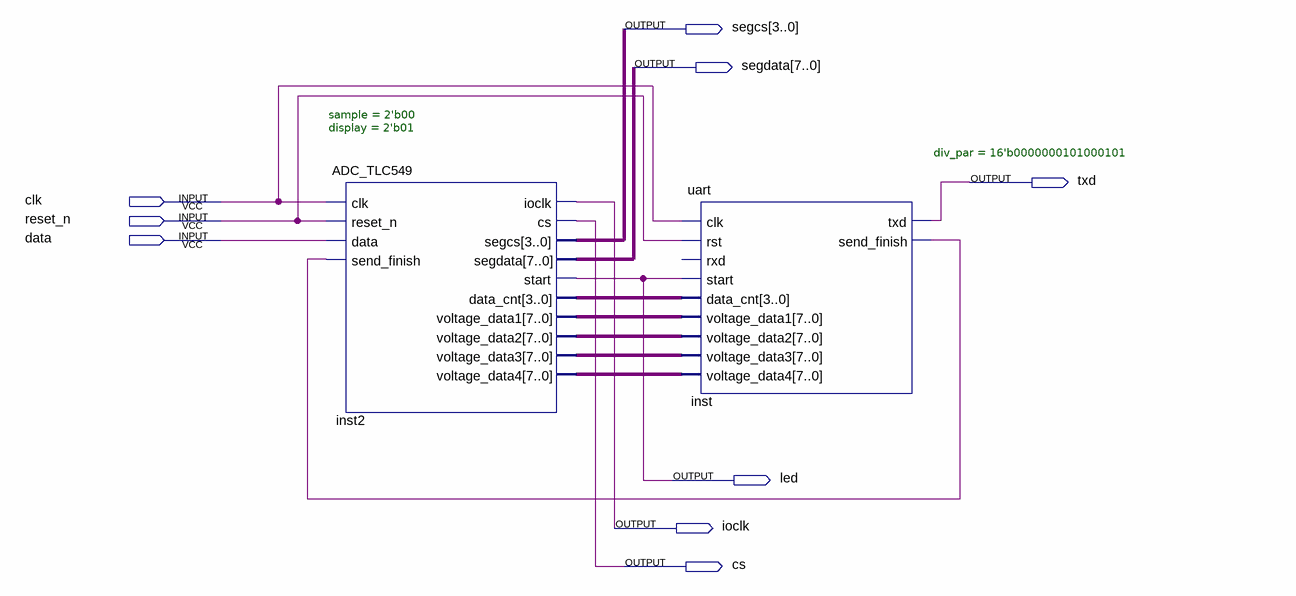
[diagram p0: schematic sheet]
// Quartus schematic top.bdf as structural Verilog: 2 symbols, 9 pins
module top (
  input  clk,
  input  reset_n,
  input  data,
  output [3:0] segcs,
  output [7:0] segdata,
  output txd,
  output led,
  output ioclk,
  output cs
);

  wire inst_send_finish;
  wire [3:0] inst2_data_cnt;
  wire [7:0] inst2_voltage_data1, inst2_voltage_data2, inst2_voltage_data3, inst2_voltage_data4;

  ADC_TLC549 #(.sample(2'b00), .display(2'b01)) inst2 (
    .clk(clk), .reset_n(reset_n), .data(data), .send_finish(inst_send_finish), .ioclk(ioclk), .cs(cs),
    .segcs(segcs), .segdata(segdata), .start(led), .data_cnt(inst2_data_cnt),
    .voltage_data1(inst2_voltage_data1), .voltage_data2(inst2_voltage_data2),
    .voltage_data3(inst2_voltage_data3), .voltage_data4(inst2_voltage_data4));
  uart #(.div_par(16'b0000000101000101)) inst (
    .clk(clk), .rst(reset_n), .start(led), .data_cnt(inst2_data_cnt), .voltage_data1(inst2_voltage_data1),
    .voltage_data2(inst2_voltage_data2), .voltage_data3(inst2_voltage_data3),
    .voltage_data4(inst2_voltage_data4), .txd(txd), .send_finish(inst_send_finish));  // open: rxd
endmodule
